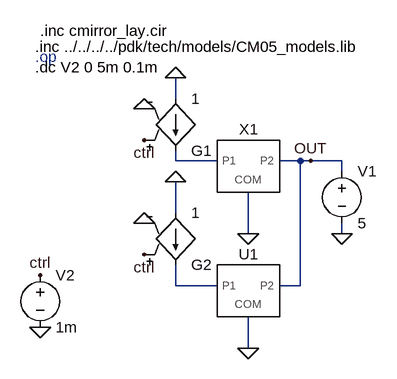
[diagram p0: schematic cmirror_sim.asc]
cmirror_sim.asc, the LTspice schematic file:
Version 4.1
SHEET 1 880 680
WIRE 96 64 96 32
WIRE 96 160 96 144
WIRE 160 160 96 160
WIRE 288 160 256 160
WIRE 304 160 288 160
WIRE 352 160 304 160
WIRE 352 176 352 160
WIRE 96 240 96 192
WIRE 208 272 208 208
WIRE 352 272 352 256
WIRE 96 352 96 320
WIRE 160 352 96 352
WIRE 288 352 288 160
WIRE 288 352 256 352
WIRE 208 448 208 400
FLAG 208 272 0
FLAG 352 272 0
FLAG 96 32 0
FLAG 304 160 OUT
FLAG 208 448 0
FLAG 96 192 0
FLAG -112 416 0
FLAG -112 336 ctrl
FLAG 48 304 ctrl
FLAG 48 128 ctrl
FLAG 48 256 0
FLAG 48 80 0
SYMBOL cmirror 192 176 R0
SYMATTR InstName X1
SYMBOL voltage 352 160 R0
WINDOW 123 0 0 Left 0
WINDOW 39 0 0 Left 0
SYMATTR InstName V1
SYMATTR Value 5
SYMBOL cmirror_lay 192 368 R0
SYMATTR InstName U1
SYMBOL g 96 160 M180
SYMATTR InstName G1
SYMATTR Value 1
SYMBOL g 96 336 M180
SYMATTR InstName G2
SYMATTR Value 1
SYMBOL voltage -112 320 R0
WINDOW 123 0 0 Left 0
WINDOW 39 0 0 Left 0
SYMATTR InstName V2
SYMATTR Value 1m
TEXT -120 0 Left 2 ;.op
TEXT -120 -16 Left 2 !.inc ../../../../pdk/tech/models/CM05_models.lib
TEXT -120 16 Left 2 !.dc V2 0 5m 0.1m
TEXT -112 -40 Left 2 !.inc cmirror_lay.cir

The netlist it stands for:
* cmirror_sim.asc
X§X1 0 N001 OUT cmirror  ; pins COM P1 P2
V1 OUT 0 5
X§U1 N002 OUT 0 cmirror_lay  ; pins P1 P2 COM
G1 0 N001 ctrl 0 1
G2 0 N002 ctrl 0 1
V2 ctrl 0 1m
* .op
.inc ../../../../pdk/tech/models/CM05_models.lib
.dc V2 0 5m 0.1m
.inc cmirror_lay.cir
.backanno
.end